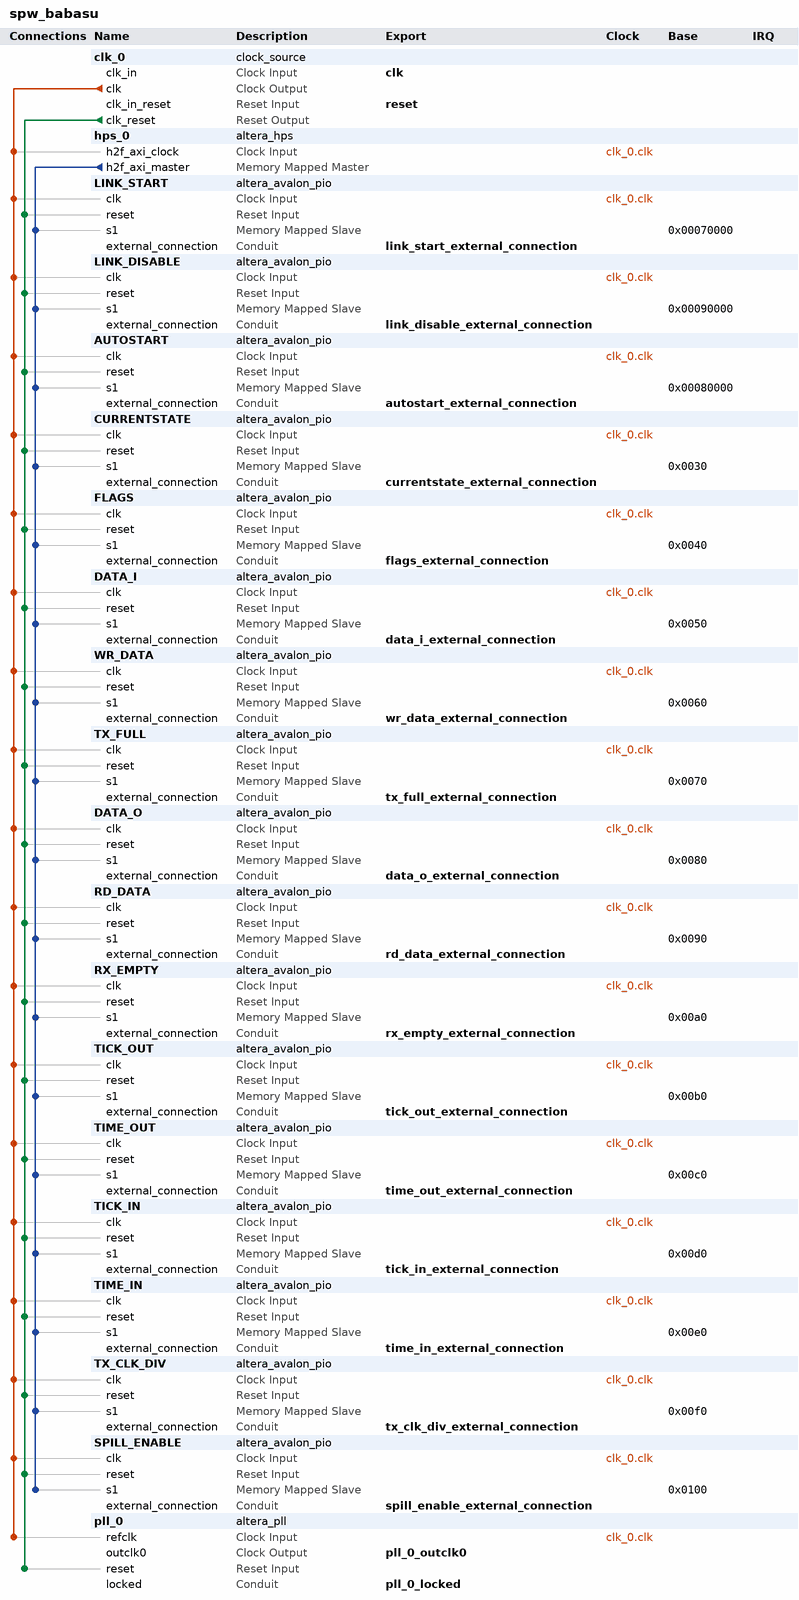
[diagram p0: system contents]
# Platform Designer (Qsys) system spw_babasu, Cyclone V 5CSEMA4U23C6
# Parameters at their usual value, and those the tool derives, are not listed.
package require -exact qsys 17.1
create_system spw_babasu
set_project_property DEVICE_FAMILY {Cyclone V}
set_project_property DEVICE 5CSEMA4U23C6

add_instance clk_0 clock_source 17.1
set_instance_parameter_value clk_0 clockFrequency 50000000

add_instance hps_0 altera_hps 17.1
set_instance_parameter_value hps_0 EMAC1_Mode N/A
set_instance_parameter_value hps_0 EMAC1_PinMuxing Unused
set_instance_parameter_value hps_0 F2SCLK_COLDRST_Enable false
set_instance_parameter_value hps_0 F2SCLK_DBGRST_Enable false
set_instance_parameter_value hps_0 F2SCLK_WARMRST_Enable false
set_instance_parameter_value hps_0 F2SINTERRUPT_Enable false
set_instance_parameter_value hps_0 F2S_Width 0
set_instance_parameter_value hps_0 FPGA_PERIPHERAL_OUTPUT_CLOCK_FREQ_EMAC0_GTX_CLK 125
set_instance_parameter_value hps_0 FPGA_PERIPHERAL_OUTPUT_CLOCK_FREQ_EMAC0_MD_CLK 2.5
set_instance_parameter_value hps_0 FPGA_PERIPHERAL_OUTPUT_CLOCK_FREQ_EMAC1_GTX_CLK 125
set_instance_parameter_value hps_0 FPGA_PERIPHERAL_OUTPUT_CLOCK_FREQ_EMAC1_MD_CLK 2.5
set_instance_parameter_value hps_0 HPS_PROTOCOL DDR3
set_instance_parameter_value hps_0 I2C0_Mode N/A
set_instance_parameter_value hps_0 I2C0_PinMuxing Unused
set_instance_parameter_value hps_0 I2C1_Mode N/A
set_instance_parameter_value hps_0 I2C1_PinMuxing Unused
set_instance_parameter_value hps_0 LWH2F_Enable false
set_instance_parameter_value hps_0 MEM_BANKADDR_WIDTH 3
set_instance_parameter_value hps_0 MEM_CLK_FREQ 300.0
set_instance_parameter_value hps_0 MEM_CLK_FREQ_MAX 400.0
set_instance_parameter_value hps_0 MEM_COL_ADDR_WIDTH 8
set_instance_parameter_value hps_0 MEM_DQ_WIDTH 8
set_instance_parameter_value hps_0 MEM_DRV_STR RZQ/6
set_instance_parameter_value hps_0 MEM_ROW_ADDR_WIDTH 12
set_instance_parameter_value hps_0 MEM_RTT_NOM {ODT Disabled}
set_instance_parameter_value hps_0 MEM_RTT_WR {Dynamic ODT off}
set_instance_parameter_value hps_0 MEM_TCL 7
set_instance_parameter_value hps_0 MEM_TFAW_NS 37.5
set_instance_parameter_value hps_0 MEM_TINIT_US 499
set_instance_parameter_value hps_0 MEM_TMRD_CK 3
set_instance_parameter_value hps_0 MEM_TRAS_NS 40.0
set_instance_parameter_value hps_0 MEM_TRCD_NS 15.0
set_instance_parameter_value hps_0 MEM_TREFI_US 7.0
set_instance_parameter_value hps_0 MEM_TRFC_NS 75.0
set_instance_parameter_value hps_0 MEM_TRP_NS 15.0
set_instance_parameter_value hps_0 MEM_TWTR 2
set_instance_parameter_value hps_0 MEM_VENDOR JEDEC
set_instance_parameter_value hps_0 MEM_WTCL 6
set_instance_parameter_value hps_0 QSPI_Mode N/A
set_instance_parameter_value hps_0 QSPI_PinMuxing Unused
set_instance_parameter_value hps_0 REF_CLK_FREQ 125.0
set_instance_parameter_value hps_0 S2FCLK_USER2CLK 5
set_instance_parameter_value hps_0 S2F_Width 1
set_instance_parameter_value hps_0 SDIO_Mode N/A
set_instance_parameter_value hps_0 SDIO_PinMuxing Unused
set_instance_parameter_value hps_0 SPIM1_Mode N/A
set_instance_parameter_value hps_0 SPIM1_PinMuxing Unused
set_instance_parameter_value hps_0 STM_Enable false
set_instance_parameter_value hps_0 TIMING_BOARD_AC_SKEW 0.02
set_instance_parameter_value hps_0 TIMING_BOARD_AC_TO_CK_SKEW 0.0
set_instance_parameter_value hps_0 TIMING_BOARD_DQ_TO_DQS_SKEW 0.0
set_instance_parameter_value hps_0 TIMING_BOARD_MAX_CK_DELAY 0.6
set_instance_parameter_value hps_0 TIMING_BOARD_MAX_DQS_DELAY 0.6
set_instance_parameter_value hps_0 TIMING_BOARD_SKEW_BETWEEN_DQS 0.02
set_instance_parameter_value hps_0 TIMING_BOARD_SKEW_CKDQS_DIMM_MAX 0.01
set_instance_parameter_value hps_0 TIMING_BOARD_SKEW_CKDQS_DIMM_MIN -0.01
set_instance_parameter_value hps_0 TIMING_BOARD_SKEW_WITHIN_DQS 0.02
set_instance_parameter_value hps_0 TIMING_TDH 125
set_instance_parameter_value hps_0 TIMING_TDQSCK 400
set_instance_parameter_value hps_0 TIMING_TDQSQ 120
set_instance_parameter_value hps_0 TIMING_TDS 50
set_instance_parameter_value hps_0 TIMING_TIH 250
set_instance_parameter_value hps_0 TIMING_TIS 175
set_instance_parameter_value hps_0 TIMING_TQSH 0.38
set_instance_parameter_value hps_0 UART0_Mode N/A
set_instance_parameter_value hps_0 UART0_PinMuxing Unused
set_instance_parameter_value hps_0 USB1_Mode N/A
set_instance_parameter_value hps_0 USB1_PinMuxing Unused
set_instance_parameter_value hps_0 desired_cfg_clk_mhz 100.0
set_instance_parameter_value hps_0 desired_qspi_clk_mhz 400.0
set_instance_parameter_value hps_0 eosc1_clk_mhz 50.0
set_instance_parameter_value hps_0 eosc2_clk_mhz 50.0

add_instance LINK_START altera_avalon_pio 17.1
set_instance_parameter_value LINK_START direction Output
set_instance_parameter_value LINK_START width 1

add_instance LINK_DISABLE altera_avalon_pio 17.1
set_instance_parameter_value LINK_DISABLE direction Output
set_instance_parameter_value LINK_DISABLE width 1

add_instance AUTOSTART altera_avalon_pio 17.1
set_instance_parameter_value AUTOSTART direction Output
set_instance_parameter_value AUTOSTART width 1

add_instance CURRENTSTATE altera_avalon_pio 17.1
set_instance_parameter_value CURRENTSTATE direction Input
set_instance_parameter_value CURRENTSTATE width 3

add_instance FLAGS altera_avalon_pio 17.1
set_instance_parameter_value FLAGS direction Input
set_instance_parameter_value FLAGS width 11

add_instance DATA_I altera_avalon_pio 17.1
set_instance_parameter_value DATA_I direction Output
set_instance_parameter_value DATA_I width 9

add_instance WR_DATA altera_avalon_pio 17.1
set_instance_parameter_value WR_DATA direction Output
set_instance_parameter_value WR_DATA width 1

add_instance TX_FULL altera_avalon_pio 17.1
set_instance_parameter_value TX_FULL direction Input
set_instance_parameter_value TX_FULL width 1

add_instance DATA_O altera_avalon_pio 17.1
set_instance_parameter_value DATA_O direction Input
set_instance_parameter_value DATA_O width 9

add_instance RD_DATA altera_avalon_pio 17.1
set_instance_parameter_value RD_DATA direction Output
set_instance_parameter_value RD_DATA width 1

add_instance RX_EMPTY altera_avalon_pio 17.1
set_instance_parameter_value RX_EMPTY direction Input
set_instance_parameter_value RX_EMPTY width 1

add_instance TICK_OUT altera_avalon_pio 17.1
set_instance_parameter_value TICK_OUT direction Input
set_instance_parameter_value TICK_OUT width 1

add_instance TIME_OUT altera_avalon_pio 17.1
set_instance_parameter_value TIME_OUT direction Input
set_instance_parameter_value TIME_OUT width 8

add_instance TICK_IN altera_avalon_pio 17.1
set_instance_parameter_value TICK_IN direction Output
set_instance_parameter_value TICK_IN width 1

add_instance TIME_IN altera_avalon_pio 17.1
set_instance_parameter_value TIME_IN direction Output
set_instance_parameter_value TIME_IN width 8

add_instance TX_CLK_DIV altera_avalon_pio 17.1
set_instance_parameter_value TX_CLK_DIV direction Output
set_instance_parameter_value TX_CLK_DIV resetValue 3
set_instance_parameter_value TX_CLK_DIV width 7

add_instance SPILL_ENABLE altera_avalon_pio 17.1
set_instance_parameter_value SPILL_ENABLE direction Output
set_instance_parameter_value SPILL_ENABLE width 1

add_instance pll_0 altera_pll 17.1
set_instance_parameter_value pll_0 gui_device_speed_grade 1
set_instance_parameter_value pll_0 gui_number_of_clocks 1
set_instance_parameter_value pll_0 gui_operation_mode direct
set_instance_parameter_value pll_0 gui_output_clock_frequency0 200.0
set_instance_parameter_value pll_0 gui_pll_mode {Integer-N PLL}
set_instance_parameter_value pll_0 gui_reference_clock_frequency 50.0
set_instance_parameter_value pll_0 gui_use_locked true

# connections
add_connection clk_0.clk AUTOSTART.clk clock
add_connection clk_0.clk CURRENTSTATE.clk clock
add_connection clk_0.clk DATA_I.clk clock
add_connection clk_0.clk DATA_O.clk clock
add_connection clk_0.clk FLAGS.clk clock
add_connection clk_0.clk hps_0.h2f_axi_clock clock
add_connection clk_0.clk LINK_DISABLE.clk clock
add_connection clk_0.clk LINK_START.clk clock
add_connection clk_0.clk pll_0.refclk clock
add_connection clk_0.clk RD_DATA.clk clock
add_connection clk_0.clk RX_EMPTY.clk clock
add_connection clk_0.clk SPILL_ENABLE.clk clock
add_connection clk_0.clk TICK_IN.clk clock
add_connection clk_0.clk TICK_OUT.clk clock
add_connection clk_0.clk TIME_IN.clk clock
add_connection clk_0.clk TIME_OUT.clk clock
add_connection clk_0.clk TX_CLK_DIV.clk clock
add_connection clk_0.clk TX_FULL.clk clock
add_connection clk_0.clk WR_DATA.clk clock
add_connection clk_0.clk_reset AUTOSTART.reset reset
add_connection clk_0.clk_reset CURRENTSTATE.reset reset
add_connection clk_0.clk_reset DATA_I.reset reset
add_connection clk_0.clk_reset DATA_O.reset reset
add_connection clk_0.clk_reset FLAGS.reset reset
add_connection clk_0.clk_reset LINK_DISABLE.reset reset
add_connection clk_0.clk_reset LINK_START.reset reset
add_connection clk_0.clk_reset pll_0.reset reset
add_connection clk_0.clk_reset RD_DATA.reset reset
add_connection clk_0.clk_reset RX_EMPTY.reset reset
add_connection clk_0.clk_reset SPILL_ENABLE.reset reset
add_connection clk_0.clk_reset TICK_IN.reset reset
add_connection clk_0.clk_reset TICK_OUT.reset reset
add_connection clk_0.clk_reset TIME_IN.reset reset
add_connection clk_0.clk_reset TIME_OUT.reset reset
add_connection clk_0.clk_reset TX_CLK_DIV.reset reset
add_connection clk_0.clk_reset TX_FULL.reset reset
add_connection clk_0.clk_reset WR_DATA.reset reset
add_connection hps_0.h2f_axi_master AUTOSTART.s1 avalon
set_connection_parameter_value hps_0.h2f_axi_master/AUTOSTART.s1 baseAddress 0x00080000
add_connection hps_0.h2f_axi_master CURRENTSTATE.s1 avalon
set_connection_parameter_value hps_0.h2f_axi_master/CURRENTSTATE.s1 baseAddress 0x0030
add_connection hps_0.h2f_axi_master DATA_I.s1 avalon
set_connection_parameter_value hps_0.h2f_axi_master/DATA_I.s1 baseAddress 0x0050
add_connection hps_0.h2f_axi_master DATA_O.s1 avalon
set_connection_parameter_value hps_0.h2f_axi_master/DATA_O.s1 baseAddress 0x0080
add_connection hps_0.h2f_axi_master FLAGS.s1 avalon
set_connection_parameter_value hps_0.h2f_axi_master/FLAGS.s1 baseAddress 0x0040
add_connection hps_0.h2f_axi_master LINK_DISABLE.s1 avalon
set_connection_parameter_value hps_0.h2f_axi_master/LINK_DISABLE.s1 baseAddress 0x00090000
add_connection hps_0.h2f_axi_master LINK_START.s1 avalon
set_connection_parameter_value hps_0.h2f_axi_master/LINK_START.s1 baseAddress 0x00070000
add_connection hps_0.h2f_axi_master RD_DATA.s1 avalon
set_connection_parameter_value hps_0.h2f_axi_master/RD_DATA.s1 baseAddress 0x0090
add_connection hps_0.h2f_axi_master RX_EMPTY.s1 avalon
set_connection_parameter_value hps_0.h2f_axi_master/RX_EMPTY.s1 baseAddress 0x00a0
add_connection hps_0.h2f_axi_master SPILL_ENABLE.s1 avalon
set_connection_parameter_value hps_0.h2f_axi_master/SPILL_ENABLE.s1 baseAddress 0x0100
add_connection hps_0.h2f_axi_master TICK_IN.s1 avalon
set_connection_parameter_value hps_0.h2f_axi_master/TICK_IN.s1 baseAddress 0x00d0
add_connection hps_0.h2f_axi_master TICK_OUT.s1 avalon
set_connection_parameter_value hps_0.h2f_axi_master/TICK_OUT.s1 baseAddress 0x00b0
add_connection hps_0.h2f_axi_master TIME_IN.s1 avalon
set_connection_parameter_value hps_0.h2f_axi_master/TIME_IN.s1 baseAddress 0x00e0
add_connection hps_0.h2f_axi_master TIME_OUT.s1 avalon
set_connection_parameter_value hps_0.h2f_axi_master/TIME_OUT.s1 baseAddress 0x00c0
add_connection hps_0.h2f_axi_master TX_CLK_DIV.s1 avalon
set_connection_parameter_value hps_0.h2f_axi_master/TX_CLK_DIV.s1 baseAddress 0x00f0
add_connection hps_0.h2f_axi_master TX_FULL.s1 avalon
set_connection_parameter_value hps_0.h2f_axi_master/TX_FULL.s1 baseAddress 0x0070
add_connection hps_0.h2f_axi_master WR_DATA.s1 avalon
set_connection_parameter_value hps_0.h2f_axi_master/WR_DATA.s1 baseAddress 0x0060

# exported interfaces
add_interface autostart_external_connection conduit end
set_interface_property autostart_external_connection EXPORT_OF AUTOSTART.external_connection
add_interface clk clock sink
set_interface_property clk EXPORT_OF clk_0.clk_in
add_interface currentstate_external_connection conduit end
set_interface_property currentstate_external_connection EXPORT_OF CURRENTSTATE.external_connection
add_interface data_i_external_connection conduit end
set_interface_property data_i_external_connection EXPORT_OF DATA_I.external_connection
add_interface data_o_external_connection conduit end
set_interface_property data_o_external_connection EXPORT_OF DATA_O.external_connection
add_interface flags_external_connection conduit end
set_interface_property flags_external_connection EXPORT_OF FLAGS.external_connection
add_interface link_disable_external_connection conduit end
set_interface_property link_disable_external_connection EXPORT_OF LINK_DISABLE.external_connection
add_interface link_start_external_connection conduit end
set_interface_property link_start_external_connection EXPORT_OF LINK_START.external_connection
add_interface pll_0_locked conduit end
set_interface_property pll_0_locked EXPORT_OF pll_0.locked
add_interface pll_0_outclk0 clock source
set_interface_property pll_0_outclk0 EXPORT_OF pll_0.outclk0
add_interface rd_data_external_connection conduit end
set_interface_property rd_data_external_connection EXPORT_OF RD_DATA.external_connection
add_interface reset reset sink
set_interface_property reset EXPORT_OF clk_0.clk_in_reset
add_interface rx_empty_external_connection conduit end
set_interface_property rx_empty_external_connection EXPORT_OF RX_EMPTY.external_connection
add_interface spill_enable_external_connection conduit end
set_interface_property spill_enable_external_connection EXPORT_OF SPILL_ENABLE.external_connection
add_interface tick_in_external_connection conduit end
set_interface_property tick_in_external_connection EXPORT_OF TICK_IN.external_connection
add_interface tick_out_external_connection conduit end
set_interface_property tick_out_external_connection EXPORT_OF TICK_OUT.external_connection
add_interface time_in_external_connection conduit end
set_interface_property time_in_external_connection EXPORT_OF TIME_IN.external_connection
add_interface time_out_external_connection conduit end
set_interface_property time_out_external_connection EXPORT_OF TIME_OUT.external_connection
add_interface tx_clk_div_external_connection conduit end
set_interface_property tx_clk_div_external_connection EXPORT_OF TX_CLK_DIV.external_connection
add_interface tx_full_external_connection conduit end
set_interface_property tx_full_external_connection EXPORT_OF TX_FULL.external_connection
add_interface wr_data_external_connection conduit end
set_interface_property wr_data_external_connection EXPORT_OF WR_DATA.external_connection

set_interconnect_requirement {$system} qsys_mm.clockCrossingAdapter HANDSHAKE
set_interconnect_requirement {$system} qsys_mm.enableEccProtection FALSE
set_interconnect_requirement {$system} qsys_mm.insertDefaultSlave FALSE
set_interconnect_requirement {$system} qsys_mm.maxAdditionalLatency 1

save_system spw_babasu.qsys
